# Altium schematic sheet Watchdog.SchDoc: Watchdog
size A4; Author: Francisco Chen Jin; CompanyName: LART; DrawnBy: João Vieira; Organization: LART; Address1: Morro do lena; Address2: Alto Do Vieiro; Address3: APT 4163, Building D; SheetNumber: 11; SheetTotal: 12; CheckedBy1: João Vieira; ProjectTitle: Autonomous Control Unit
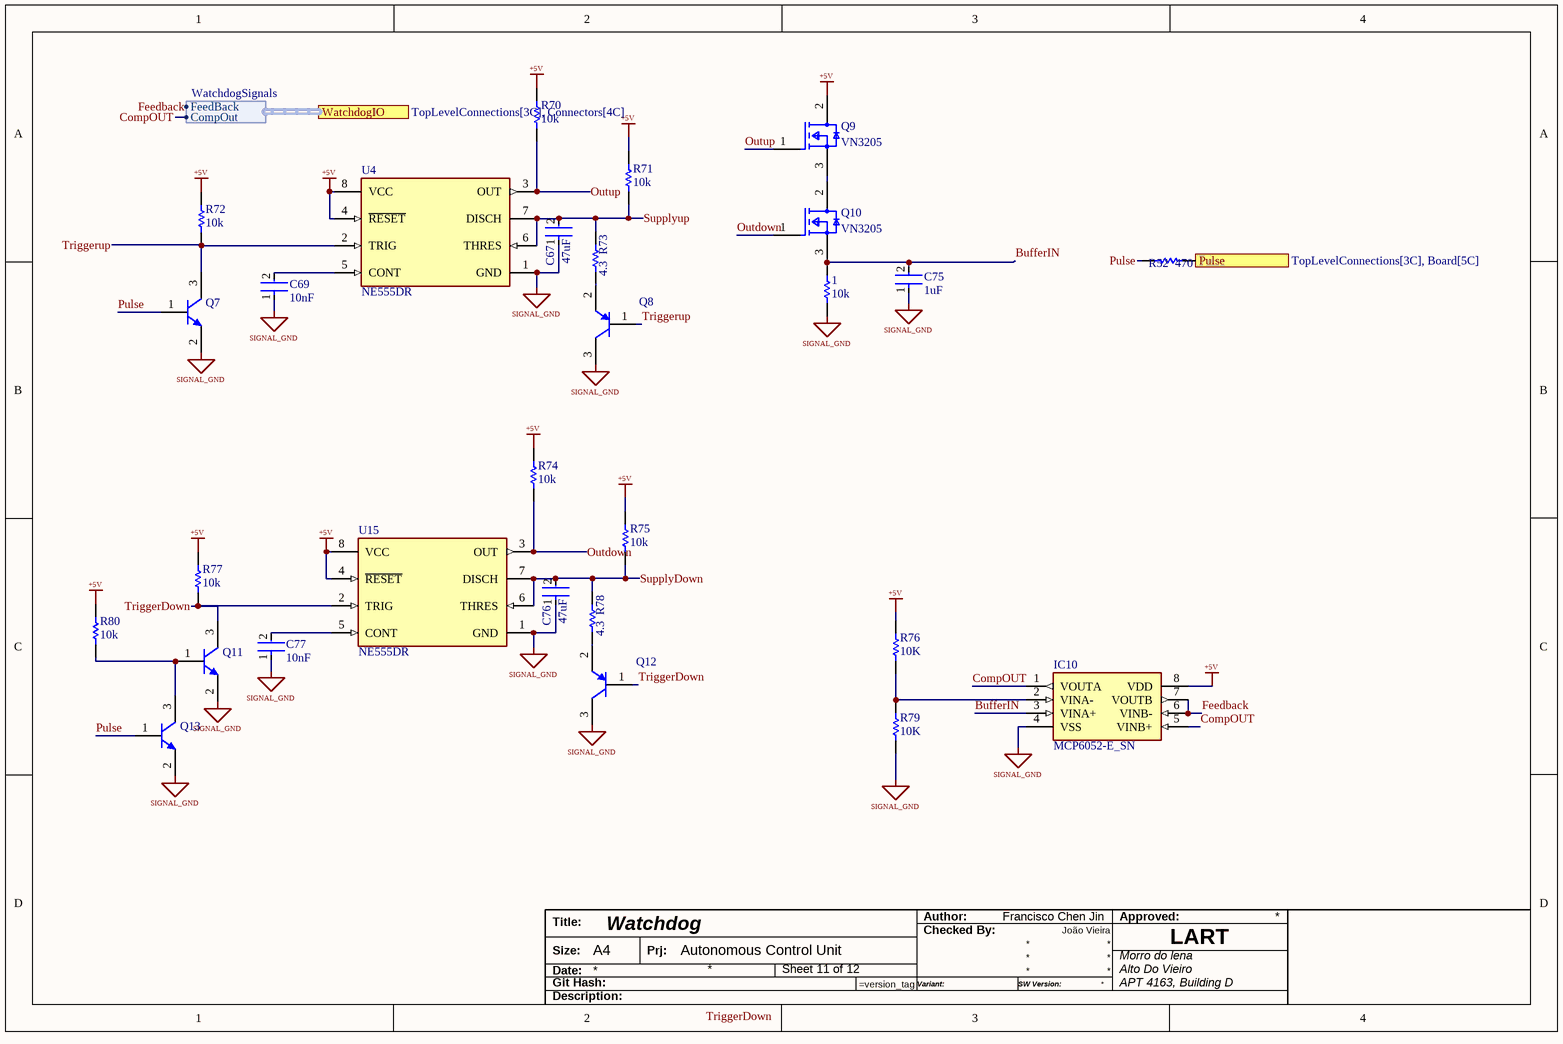
[diagram p0: Watchdog.SchDoc]

## Parts
1  10k  [RESC2013X50X30LL20T20]
C67  47uF  [FP-0805-L_2_01_0_2-W_1_25-IPC_B]
C69  10nF  [FP-0805-L_2_01_0_2-W_1_25-IPC_B]
C75  1uF  [FP-0805-L_2_01_0_2-W_1_25-IPC_B]
C76  47uF  [FP-0805-L_2_01_0_2-W_1_25-IPC_B]
C77  10nF  [FP-0805-L_2_01_0_2-W_1_25-IPC_B]
IC10  MCP6052-E_SN  [SOIC127P600X175-8N]
Q7  MMBTA42LT1G  [ONSC-SOT-23-3-318-08_V]  (value not drawn)
Q8  MMBT4403LT1G  [ONSC-SOT-23-3-318-08_V]  (value not drawn)
Q9  VN3205  [FP-TN2510N8-G-IPC_C]
Q10  VN3205  [FP-TN2510N8-G-IPC_C]
Q11  MMBTA42LT1G  [ONSC-SOT-23-3-318-08_V]  (value not drawn)
Q12  MMBT4403LT1G  [ONSC-SOT-23-3-318-08_V]  (value not drawn)
Q13  MMBTA42LT1G  [ONSC-SOT-23-3-318-08_V]  (value not drawn)
R52  470  [RESC2013X50X30LL20T20]
R70  10k  [RESC2013X50X30LL20T20]
R71  10k  [RESC2013X50X30LL20T20]
R72  10k  [RESC2013X50X30LL20T20]
R73  4.3  [RESC2013X50X30LL20T20]
R74  10k  [RESC2013X50X30LL20T20]
R75  10k  [RESC2013X50X30LL20T20]
R76  10K  [RESC2013X50X30LL20T20]
R77  10k  [RESC2013X50X30LL20T20]
R78  4.3  [RESC2013X50X30LL20T20]
R79  10K  [RESC2013X50X30LL20T20]
R80  10k  [RESC2013X50X30LL20T20]
U4  NE555DR  [FP-D0008A-IPC_A]
U15  NE555DR  [FP-D0008A-IPC_A]

## Ports
Pulse (in, see TopLevelConnections[3C], Board[5C]), WatchdogIO (harness WatchdogSignals, see TopLevelConnections[3C], Connectors[4C])

## Harnesses
WatchdogSignals: FeedBack, CompOut

## Nets
+5V: IC10.8(VDD) Q9.2(DRAIN) R70.2 R71.1 R72.1 R74.2 R75.1 R76.1 R77.1 R80.1 U4.4(~{RESET}) U4.8(VCC) U15.4(~{RESET}) U15.8(VCC)
SIGNAL_GND: 1.1 C67.1 C69.1 C75.1 C76.1 C77.1 IC10.4(VSS) Q7.2(E) Q8.3(C) Q11.2(E) Q12.3(C) Q13.2(E) R79.2 U4.1(GND) U15.1(GND)
BufferIN: 1.2 C75.2 IC10.3(VINA+) Q10.3(SOURCE)
CompOUT: IC10.1(VOUTA) IC10.5(VINB+) ; port WatchdogIO.CompOut
Feedback: IC10.6(VINB-) IC10.7(VOUTB) ; port WatchdogIO.FeedBack
Outdown: Q10.1(GATE) R74.1 U15.3(OUT)
Outup: Q9.1(GATE) R70.1 U4.3(OUT)
Pulse: Q7.1(B) Q13.1(B) R52.1
Pulse: R52.2 ; port Pulse  [a separate net that carries the same name]
SupplyDown: C76.2 R75.2 R78.2 U15.6(THRES) U15.7(DISCH)
Supplyup: C67.2 R71.2 R73.2 U4.6(THRES) U4.7(DISCH)
TriggerDown: Q11.3(C) Q12.1(B) R77.2 U15.2(TRIG)
Triggerup: Q7.3(C) Q8.1(B) R72.2 U4.2(TRIG)
NetC69_2: C69.2 U4.5(CONT)
NetC77_2: C77.2 U15.5(CONT)
NetIC10_2: IC10.2(VINA-) R76.2 R79.1
NetQ8_2: Q8.2(E) R73.1
NetQ9_3: Q9.3(SOURCE) Q10.2(DRAIN)
NetQ11_1: Q11.1(B) Q13.3(C) R80.2
NetQ12_2: Q12.2(E) R78.1

## Notes on the sheet
- Labels drawn without touching a wire or pin: TriggerDown
- Title:
- Author:
- Checked By:
- Approved:
- Size:
- Date:
- Git Hash:
- A4
- Prj:
- Variant:
- SW Version:
- Description:

## Library data of the parts
1 R52 R70-R80 = CMP-2001-04896-1: Manufacturer: Vishay Dale; Part Number: CRCW08050000Z0EA
C67 C69 C75-C77 = CMP-2007-04119-2: General Purpose Ceramic Capacitor, 0805, 100pF, 1%, C0G, 30ppm/°C, 100V; Max Operating Temperature: 125°C; Lead Free: Lead Free; Tolerance: 1%; Case Code (Imperial): 0805; Dielectric: C0G; RoHS Compliant: Yes; Termination: SMD/SMT; Packaging: Tape and Reel; Depth: 1.25mm; Dielectric Material: Ceramic; REACH SVHC: No SVHC; Thickness: 0.037inch; Case Code (Metric): 2012; Series: -; Mount: Surface Mount; Min Operating Temperature: -55°C; Voltage: 100V; Capacitance: 100pF; Length: 2.01mm; Number of Pins: 2; Radiation Hardening: No; Voltage Rating: 100V; Voltage Rating (DC): 100V; Height: 0.71mm; Width: 1.25mm; Case/Package: 0805; Construction: Flat; Package Quantity: 1
IC10 = MCP6052-E_SN: Integrated Circuit; Manufacturer_Name: Microchip; Manufacturer_Part_Number: MCP6052-E/SN; Datasheet Link: http://ww1.microchip.com/downloads/en/DeviceDoc/MCP6051_DS22182B.pdf; Height: 1.75mm; Mouser Part Number: 579-MCP6052-E/SN; Mouser Price/Stock: https://www.mouser.com/Search/Refine.aspx?Keyword=579-MCP6052-E%2FSN
Q7 Q11 Q13 = CMP-1048-00662-1: High Voltage Transistor, NPN Silicon, 3-Pin SOT-23, Pb-Free, Tape and Reel; Manufacturer: On Semiconductor; fT Min (MHz): 50; IC Continuous (A): 0.5; ComponentLink1URL: http://www.onsemi.com/; ComponentLink3URL: http://www.onsemi.cn/pub_link/Collateral/318-08.PDF; RoHS: TRUE; ComponentLink2Description: Datasheet; PartNumber: MMBTA42LT1G; Polarity: NPN; DatasheetVersion: Rev. 12; PackageReference: SOT-23-3-318-08; PackageDescription: 3-Pin Small Outline Transistor, Body 2.92 x 1.3 mm, Pitch 0.95 mm; ComponentLink3Description: Package Specification; ComponentLink1Description: Manufacturer URL; Packing: Tape and Reel; PackageVersion: Rev. AP, 11/2009; Mounting Technology: Surface Mount; ComponentLink2URL: http://www.onsemi.cn/pub_link/Collateral/MMBTA42LT1-D.PDF
Q8 Q12 = CMP-1048-00539-1: Switching Transistor, PNP Silicon, 3-Pin SOT-23, Pb-Free, Tape and Reel; Manufacturer: On Semiconductor; fT Min (MHz): 200; IC Continuous (A): -0.6; ComponentLink1URL: http://www.onsemi.com/; ComponentLink2URL: http://www.onsemi.cn/pub_link/Collateral/MMBT4403LT1-D.PDF; PackageVersion: Rev. AP, 11/2009; ComponentLink1Description: Manufacturer URL; PackageDescription: 3-Pin Small Outline Transistor, Body 2.92 x 1.3 mm, Pitch 0.95 mm; Polarity: PNP; ComponentLink3Description: Package Specification; DatasheetVersion: Rev. 12; Mounting Technology: Surface Mount; PackageReference: SOT-23-3-318-08; ComponentLink3URL: http://www.onsemi.cn/pub_link/Collateral/318-08.PDF; Packing: Tape and Reel; PartNumber: MMBT4403LT1G; RoHS: TRUE; ComponentLink2Description: Datasheet
Q9 Q10 = CMP-06369-000016-1: MOSFET N-CH 100V 730MA TO243AA; Turn-On Delay Time: 10ns; Max Power Dissipation: 1.6W; Gate to Source Voltage (Vgs): 20V; Input Capacitance: 125pF; Element Configuration: Single; Drain to Source Resistance: 1.5R; Turn-Off Delay Time: 20ns; Number of Elements: 1; Polarity: N-CHANNEL; Length: 4.6mm; Packaging: Tape and Reel; Case/Package: TO-243AA; Series: -; Number of Pins: 4; Mount: Surface Mount; Contact Plating: Tin; Package Quantity: 2000; Min Operating Temperature: -55°C; Radiation Hardening: No; Lead Free: Lead Free; Height: 1.6mm; Width: 2.6mm; Weight: 0.001862oz; Rds On Max: 1.5R; Power Dissipation: 1.6W; Drain to Source Breakdown Voltage: 100V; Rise Time: 10ns; Fall Time: 10ns; Continuous Drain Current (ID): 730mA; Max Operating Temperature: 150°C; Number of Channels: 1
U4 U15 = CMP-1685-00007-2: IC OSC SGL TIMER 100KHZ 8-SOIC; Low Level Output Current: 200mA; Quiescent Current: 15mA; Min Supply Voltage: 4.5V; Number of Timers/Counters: 1; Max Supply Voltage: 16V; Operating Supply Current: 10mA; High Level Output Current: -200mA; Packaging: Tape and Reel; Frequency: 100kHz; Weight: 0.002561oz; REACH SVHC: No SVHC; Package Quantity: 2500; Width: 3.91mm; Max Operating Temperature: 70°C; Contact Plating: Gold; Lead Free: Lead Free; Number of Pins: 8; Min Operating Temperature: 0°C; Radiation Hardening: No; Length: 4.9mm; Case/Package: SOIC; Height: 1.58mm; Mount: Surface Mount